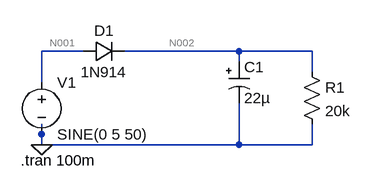
[diagram p0: schematic half_wave_rectifier2.asc]
half_wave_rectifier2.asc, the LTspice schematic file:
Version 4
SHEET 1 880 680
WIRE 96 160 32 160
WIRE 336 160 160 160
WIRE 448 160 336 160
WIRE 336 176 336 160
WIRE 448 192 448 160
WIRE 32 208 32 160
WIRE 32 288 32 272
WIRE 32 304 32 288
WIRE 336 304 336 240
WIRE 336 304 32 304
WIRE 448 304 448 272
WIRE 448 304 336 304
FLAG 32 304 0
SYMBOL voltage 32 192 R0
WINDOW 123 0 0 Left 0
WINDOW 39 0 0 Left 0
SYMATTR InstName V1
SYMATTR Value SINE(0 5 50)
SYMBOL res 432 176 R0
SYMATTR InstName R1
SYMATTR Value 20k
SYMBOL diode 96 176 R270
WINDOW 0 32 32 VTop 2
WINDOW 3 0 32 VBottom 2
SYMATTR InstName D1
SYMATTR Value 1N914
SYMBOL polcap 320 176 R0
WINDOW 3 24 56 Left 2
SYMATTR Value 22µ
SYMATTR InstName C1
SYMATTR Description Capacitor
SYMATTR Type cap
SYMATTR SpiceLine V=16 Irms=3.72678 Rser=0.018 Lser=0 mfg="KEMET" pn="A700D226M016ATE018" type="Al electrolytic"
TEXT 0 328 Left 2 !.tran 100m

The netlist it stands for:
* half_wave_rectifier2.asc
V1 N001 0 SINE(0 5 50)
R1 N002 0 20k
D1 N001 N002 1N914
C1 N002 0 22µ V=16 Irms=3.72678 Rser=0.018 Lser=0 mfg="KEMET" pn="A700D226M016ATE018" type="Al electrolytic"
.model D D
.lib standard.dio
.tran 100m
.backanno
.end

* Results of the author's LTspice run, read from the files saved beside the schematic
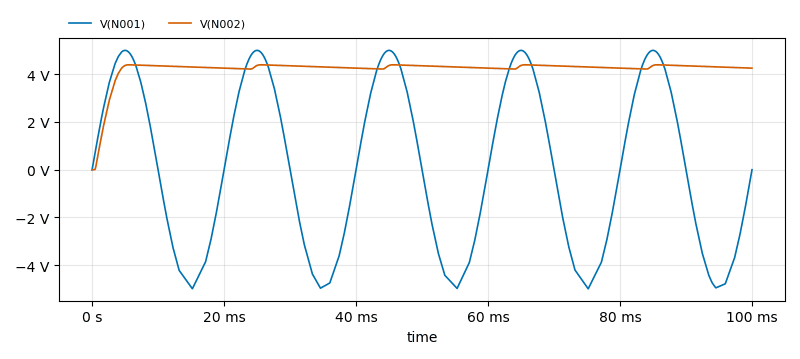
[diagram p1: Transient Analysis of half_wave_rectifier2.asc, plotted from the saved traces]
* Transient Analysis, 1 run:
*   V(N001): min -4.988 V, max 5 V, average 22.88 mV, rms 3.514 V, last 0 V
*   V(N002): min 0 V, max 4.395 V, average 4.219 V, rms 4.252 V, last 4.255 V